# Altium schematic sheet STEERING_WHEEL_SWITCHES_V2_CONTROLLER.SchDoc
size B; SheetNumber: 1; SheetTotal: 5
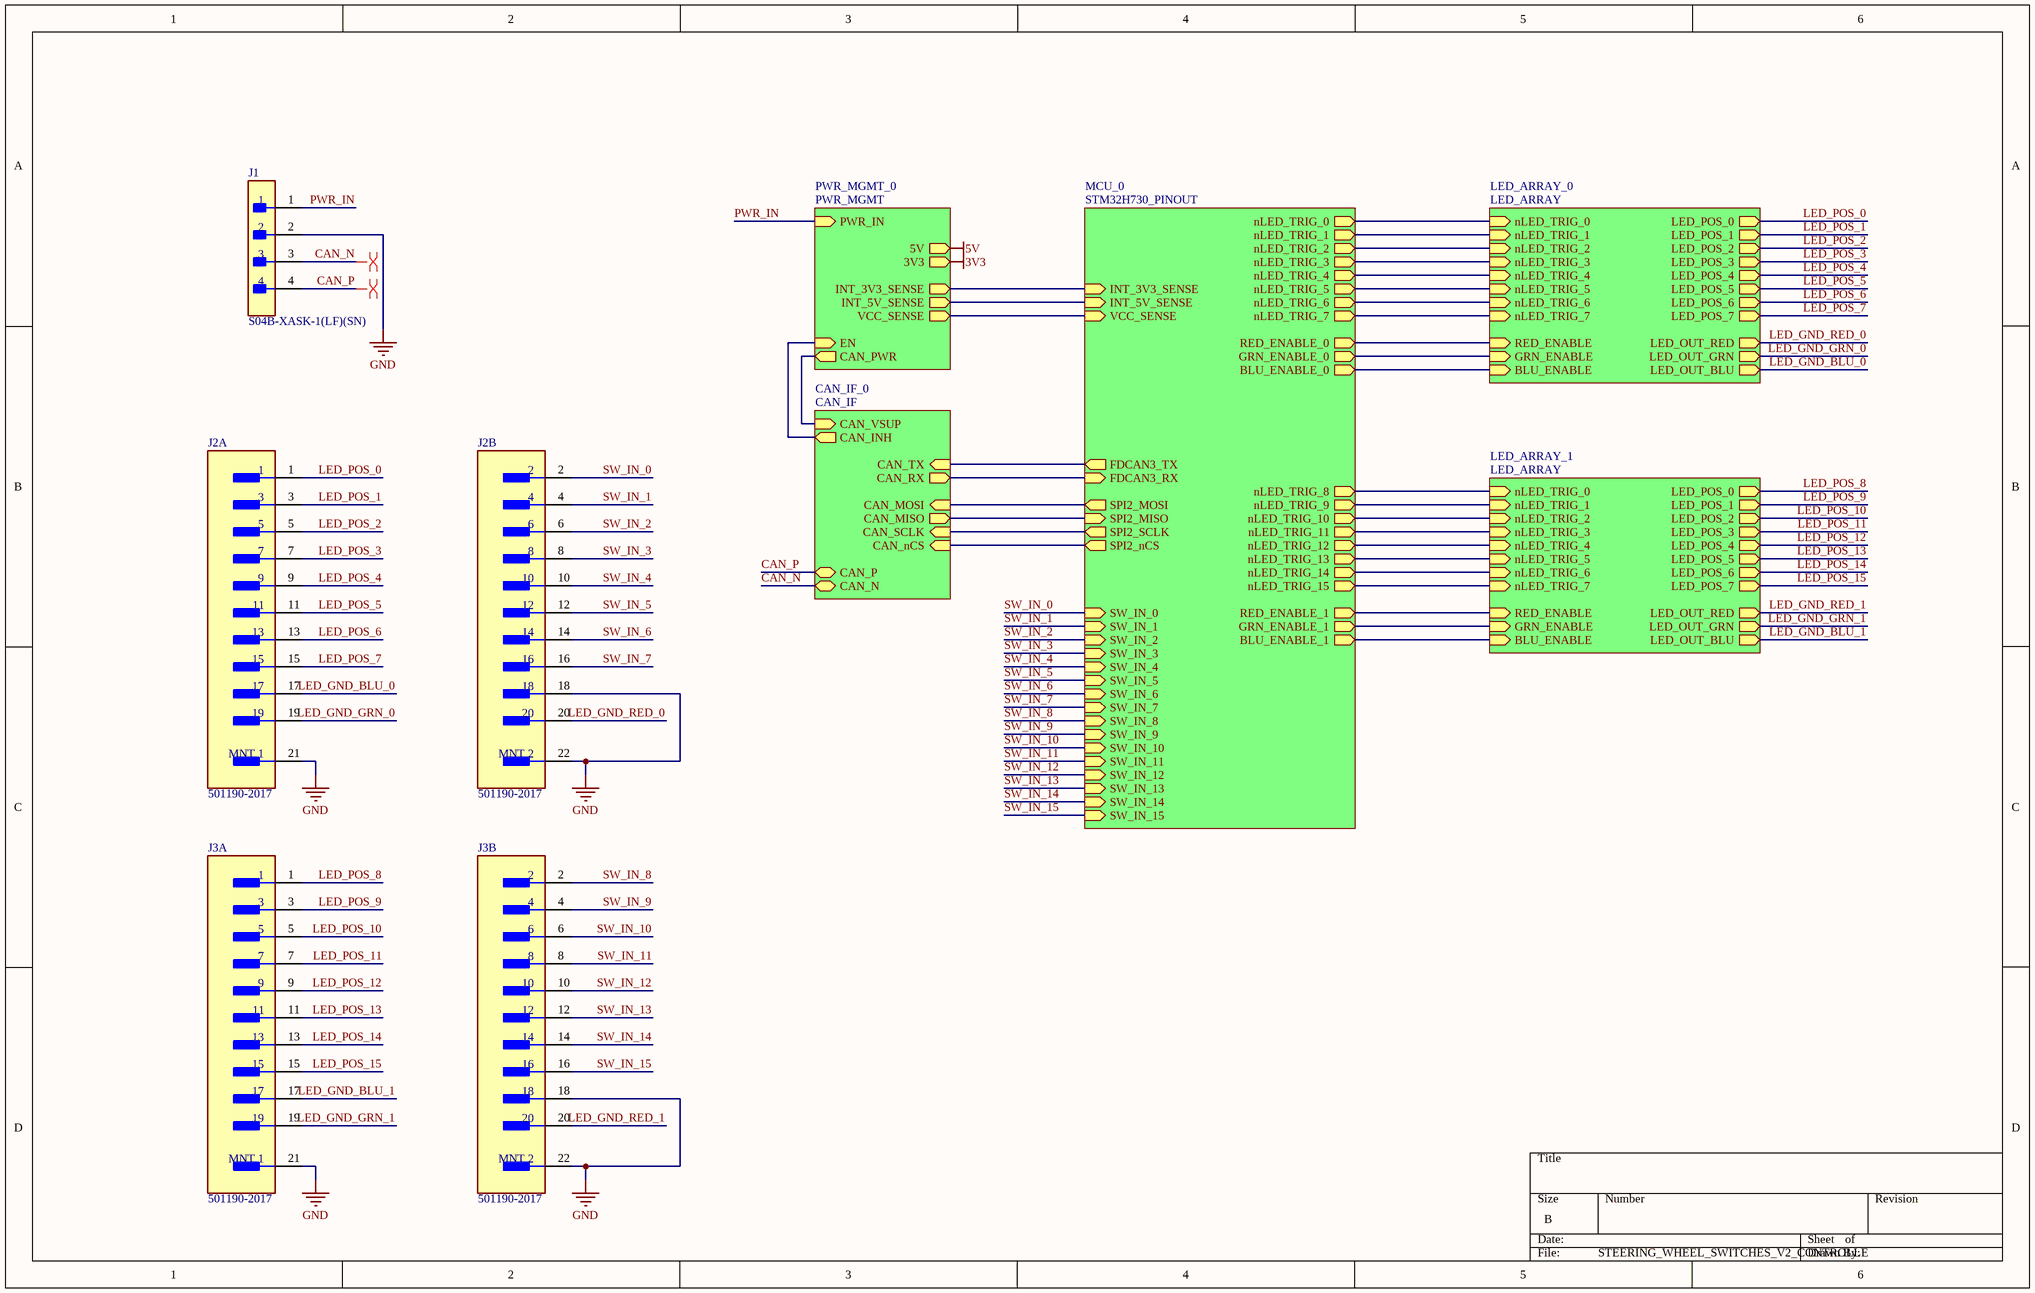
[diagram p0: STEERING_WHEEL_SWITCHES_V2_CONTROLLER.SchDoc]

## Parts
J1  S04B-XASK-1(LF)(SN)  [FP-S04B-XASK-1_LF_SN-MFG]
J2  501190-2017  [FP-501190-2017-MFG]  (parts A,B of 2)
J3  501190-2017  [FP-501190-2017-MFG]  (parts A,B of 2)

## Sub-sheets
CAN_IF_0 = CAN_IF: CAN_VSUP (in), CAN_INH (out), CAN_MOSI (in), CAN_MISO (out), CAN_SCLK (in), CAN_nCS (in), CAN_P (bidir), CAN_N (bidir), CAN_TX (in), CAN_RX (out)
LED_ARRAY_0 = LED_ARRAY: nLED_TRIG_0 (in), nLED_TRIG_1 (in), nLED_TRIG_2 (in), nLED_TRIG_3 (in), nLED_TRIG_4 (in), nLED_TRIG_5 (in), nLED_TRIG_6 (in), nLED_TRIG_7 (in), RED_ENABLE (in), GRN_ENABLE (in), BLU_ENABLE (in), LED_POS_0 (out), LED_POS_1 (out), LED_POS_2 (out), LED_POS_3 (out), LED_POS_4 (out), LED_POS_5 (out), LED_POS_6 (out), LED_POS_7 (out), LED_OUT_RED (out), LED_OUT_GRN (out), LED_OUT_BLU (out)
LED_ARRAY_1 = LED_ARRAY: nLED_TRIG_0 (in), nLED_TRIG_1 (in), nLED_TRIG_2 (in), nLED_TRIG_3 (in), nLED_TRIG_4 (in), nLED_TRIG_5 (in), nLED_TRIG_6 (in), nLED_TRIG_7 (in), RED_ENABLE (in), GRN_ENABLE (in), BLU_ENABLE (in), LED_POS_0 (out), LED_POS_1 (out), LED_POS_2 (out), LED_POS_3 (out), LED_POS_4 (out), LED_POS_5 (out), LED_POS_6 (out), LED_POS_7 (out), LED_OUT_RED (out), LED_OUT_GRN (out), LED_OUT_BLU (out)
MCU_0 = STM32H730_PINOUT: nLED_TRIG_0 (out), nLED_TRIG_1 (out), nLED_TRIG_2 (out), nLED_TRIG_3 (out), nLED_TRIG_4 (out), nLED_TRIG_5 (out), nLED_TRIG_6 (out), nLED_TRIG_7 (out), RED_ENABLE_0 (out), GRN_ENABLE_0 (out), BLU_ENABLE_0 (out), RED_ENABLE_1 (out), GRN_ENABLE_1 (out), BLU_ENABLE_1 (out), nLED_TRIG_8 (out), nLED_TRIG_9 (out), nLED_TRIG_10 (out), nLED_TRIG_11 (out), nLED_TRIG_12 (out), nLED_TRIG_13 (out), nLED_TRIG_14 (out), nLED_TRIG_15 (out), INT_3V3_SENSE (in), INT_5V_SENSE (in), VCC_SENSE (in), SW_IN_0 (in), SW_IN_1 (in), SW_IN_2 (in), SW_IN_3 (in), SW_IN_4 (in), SW_IN_5 (in), SW_IN_6 (in), SW_IN_7 (in), SW_IN_8 (in), SW_IN_9 (in), SW_IN_10 (in), SW_IN_11 (in), SW_IN_12 (in), SW_IN_13 (in), SW_IN_14 (in), SW_IN_15 (in), FDCAN3_TX (out), FDCAN3_RX (in), SPI2_MOSI (out), SPI2_MISO (in), SPI2_SCLK (out), SPI2_nCS (out)
PWR_MGMT_0 = PWR_MGMT: PWR_IN (in), 5V (out), 3V3 (out), INT_3V3_SENSE (out), INT_5V_SENSE (out), VCC_SENSE (out), CAN_PWR (out), EN (in)

## Nets
3V3: sheet PWR_MGMT_0/3V3
5V: sheet PWR_MGMT_0/5V
GND: J1.2 J2.18 J2.21(MNT_1) J2.22(MNT_2) J3.18 J3.21(MNT_1) J3.22(MNT_2)
CAN_N: J1.3 ; sheet CAN_IF_0/CAN_N
CAN_P: J1.4 ; sheet CAN_IF_0/CAN_P
LED_GND_BLU_0: J2.17 ; sheet LED_ARRAY_0/LED_OUT_BLU
LED_GND_BLU_1: J3.17 ; sheet LED_ARRAY_1/LED_OUT_BLU
LED_GND_GRN_0: J2.19 ; sheet LED_ARRAY_0/LED_OUT_GRN
LED_GND_GRN_1: J3.19 ; sheet LED_ARRAY_1/LED_OUT_GRN
LED_GND_RED_0: J2.20 ; sheet LED_ARRAY_0/LED_OUT_RED
LED_GND_RED_1: J3.20 ; sheet LED_ARRAY_1/LED_OUT_RED
LED_POS_0: J2.1 ; sheet LED_ARRAY_0/LED_POS_0
LED_POS_1: J2.3 ; sheet LED_ARRAY_0/LED_POS_1
LED_POS_2: J2.5 ; sheet LED_ARRAY_0/LED_POS_2
LED_POS_3: J2.7 ; sheet LED_ARRAY_0/LED_POS_3
LED_POS_4: J2.9 ; sheet LED_ARRAY_0/LED_POS_4
LED_POS_5: J2.11 ; sheet LED_ARRAY_0/LED_POS_5
LED_POS_6: J2.13 ; sheet LED_ARRAY_0/LED_POS_6
LED_POS_7: J2.15 ; sheet LED_ARRAY_0/LED_POS_7
LED_POS_8: J3.1 ; sheet LED_ARRAY_1/LED_POS_0
LED_POS_9: J3.3 ; sheet LED_ARRAY_1/LED_POS_1
LED_POS_10: J3.5 ; sheet LED_ARRAY_1/LED_POS_2
LED_POS_11: J3.7 ; sheet LED_ARRAY_1/LED_POS_3
LED_POS_12: J3.9 ; sheet LED_ARRAY_1/LED_POS_4
LED_POS_13: J3.11 ; sheet LED_ARRAY_1/LED_POS_5
LED_POS_14: J3.13 ; sheet LED_ARRAY_1/LED_POS_6
LED_POS_15: J3.15 ; sheet LED_ARRAY_1/LED_POS_7
PWR_IN: J1.1 ; sheet PWR_MGMT_0/PWR_IN
SW_IN_0: J2.2 ; sheet MCU_0/SW_IN_0
SW_IN_1: J2.4 ; sheet MCU_0/SW_IN_1
SW_IN_2: J2.6 ; sheet MCU_0/SW_IN_2
SW_IN_3: J2.8 ; sheet MCU_0/SW_IN_3
SW_IN_4: J2.10 ; sheet MCU_0/SW_IN_4
SW_IN_5: J2.12 ; sheet MCU_0/SW_IN_5
SW_IN_6: J2.14 ; sheet MCU_0/SW_IN_6
SW_IN_7: J2.16 ; sheet MCU_0/SW_IN_7
SW_IN_8: J3.2 ; sheet MCU_0/SW_IN_8
SW_IN_9: J3.4 ; sheet MCU_0/SW_IN_9
SW_IN_10: J3.6 ; sheet MCU_0/SW_IN_10
SW_IN_11: J3.8 ; sheet MCU_0/SW_IN_11
SW_IN_12: J3.10 ; sheet MCU_0/SW_IN_12
SW_IN_13: J3.12 ; sheet MCU_0/SW_IN_13
SW_IN_14: J3.14 ; sheet MCU_0/SW_IN_14
SW_IN_15: J3.16 ; sheet MCU_0/SW_IN_15
(unnamed): sheet MCU_0/nLED_TRIG_0, sheet LED_ARRAY_0/nLED_TRIG_0
(unnamed): sheet MCU_0/nLED_TRIG_1, sheet LED_ARRAY_0/nLED_TRIG_1
(unnamed): sheet MCU_0/nLED_TRIG_2, sheet LED_ARRAY_0/nLED_TRIG_2
(unnamed): sheet MCU_0/nLED_TRIG_3, sheet LED_ARRAY_0/nLED_TRIG_3
(unnamed): sheet MCU_0/nLED_TRIG_4, sheet LED_ARRAY_0/nLED_TRIG_4
(unnamed): sheet MCU_0/nLED_TRIG_5, sheet LED_ARRAY_0/nLED_TRIG_5
(unnamed): sheet MCU_0/nLED_TRIG_6, sheet LED_ARRAY_0/nLED_TRIG_6
(unnamed): sheet MCU_0/nLED_TRIG_7, sheet LED_ARRAY_0/nLED_TRIG_7
(unnamed): sheet MCU_0/RED_ENABLE_0, sheet LED_ARRAY_0/RED_ENABLE
(unnamed): sheet MCU_0/GRN_ENABLE_0, sheet LED_ARRAY_0/GRN_ENABLE
(unnamed): sheet MCU_0/BLU_ENABLE_0, sheet LED_ARRAY_0/BLU_ENABLE
(unnamed): sheet MCU_0/RED_ENABLE_1, sheet LED_ARRAY_1/RED_ENABLE
(unnamed): sheet MCU_0/GRN_ENABLE_1, sheet LED_ARRAY_1/GRN_ENABLE
(unnamed): sheet MCU_0/BLU_ENABLE_1, sheet LED_ARRAY_1/BLU_ENABLE
(unnamed): sheet MCU_0/nLED_TRIG_8, sheet LED_ARRAY_1/nLED_TRIG_0
(unnamed): sheet MCU_0/nLED_TRIG_9, sheet LED_ARRAY_1/nLED_TRIG_1
(unnamed): sheet MCU_0/nLED_TRIG_10, sheet LED_ARRAY_1/nLED_TRIG_2
(unnamed): sheet MCU_0/nLED_TRIG_11, sheet LED_ARRAY_1/nLED_TRIG_3
(unnamed): sheet MCU_0/nLED_TRIG_12, sheet LED_ARRAY_1/nLED_TRIG_4
(unnamed): sheet MCU_0/nLED_TRIG_13, sheet LED_ARRAY_1/nLED_TRIG_5
(unnamed): sheet MCU_0/nLED_TRIG_14, sheet LED_ARRAY_1/nLED_TRIG_6
(unnamed): sheet MCU_0/nLED_TRIG_15, sheet LED_ARRAY_1/nLED_TRIG_7
(unnamed): sheet MCU_0/INT_3V3_SENSE, sheet PWR_MGMT_0/INT_3V3_SENSE
(unnamed): sheet MCU_0/INT_5V_SENSE, sheet PWR_MGMT_0/INT_5V_SENSE
(unnamed): sheet MCU_0/VCC_SENSE, sheet PWR_MGMT_0/VCC_SENSE
(unnamed): sheet MCU_0/FDCAN3_TX, sheet CAN_IF_0/CAN_TX
(unnamed): sheet MCU_0/FDCAN3_RX, sheet CAN_IF_0/CAN_RX
(unnamed): sheet MCU_0/SPI2_MOSI, sheet CAN_IF_0/CAN_MOSI
(unnamed): sheet MCU_0/SPI2_MISO, sheet CAN_IF_0/CAN_MISO
(unnamed): sheet MCU_0/SPI2_SCLK, sheet CAN_IF_0/CAN_SCLK
(unnamed): sheet MCU_0/SPI2_nCS, sheet CAN_IF_0/CAN_nCS
(unnamed): sheet PWR_MGMT_0/CAN_PWR, sheet CAN_IF_0/CAN_VSUP
(unnamed): sheet PWR_MGMT_0/EN, sheet CAN_IF_0/CAN_INH

## Layout directives
differential pair: CAN_N, CAN_P

## Library data of the parts
J1 = CMP-17439-000091-1: CONN HEADER R/A 4POS 2.5MM; Number of Contacts: 4; Voltage Rating (AC): 250V; Current Rating: 3A; Insulation Resistance: 1GR; Gender: Male; Wire/Cable Gauge: 20AWG; Contact Resistance: 10mR; Lead Length: 3.4mm; Insulation Material: Nylon; Fastening Type: Ramp; Height: 7.6mm; Packaging: Bulk; Voltage Rating: 250V; Contact Type: Male Pin; REACH SVHC: No SVHC; Series: XA; Connector Type: Header; Number of Positions: 4; Contact Shape: Circular; Insulation Color: Natural; Contact Finish - Mating: TIN; Number of Pins: 4; Color: Beige; Orientation: Right Angle; Length: 12.5mm; Lead Free: Lead Free; Contact Material: Copper Alloy; Min Operating Temperature: -25°C; Contact Plating: Tin; Number of Poles: 4; Number of Rows: 1; Width: 12.6mm; Voltage Rating (DC): 250V; Mount: Through Hole; Flammability Rating: UL94 V-0; Max Operating Temperature: 85°C; Termination: Solder; Material: Nylon; Pitch: 2.5mm
J2 J3 = CMP-04776-000294-1: CONN HEADER SMD 20POS 1MM; Contact Resistance: 20mR; Number of Contacts: 20; Voltage Rating: 50V; Connector Type: Male Pin; Current Rating: 1A; Glow Wire Compliant: Non-compliant; Row Spacing: 0.105inch; Gender: Male; Termination: Solder; Housing Color: Natural; Package Quantity: 1100; Contact Type: Male Pin; Number of Circuits: 20; Min Operating Temperature: -40°C; Mount: Surface Mount; Length: 12.3mm; Pitch: 1mm; Housing Material: Thermoplastic; Depth: 7.27mm; Orientation: Vertical; Max Operating Temperature: 85°C; Lead Free: Lead Free; Voltage Rating (DC): 50V; Series: Pico-Clasp; Number of Rows: 2; Contact Material: Bronze; Contact Plating: Gold; Color: Natural; Radiation Hardening: No; Fastening Type: Latch; Packaging: Tape and Reel; Number of Positions: 20